# EAGLE design HelveTiny84 (EAGLE 7.5.0)

## Sheet 1 of 2
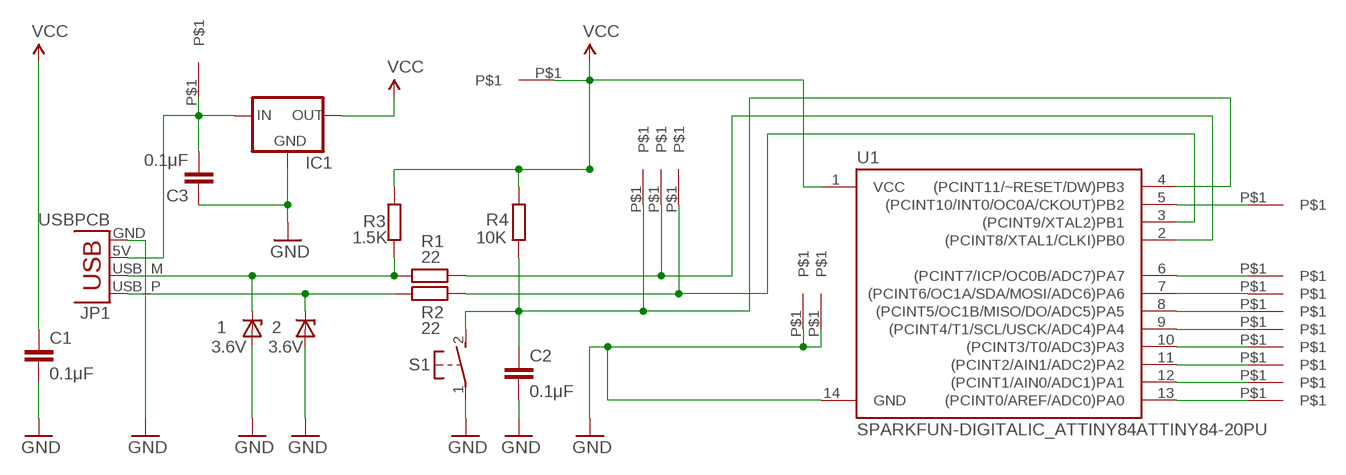
[diagram p0: schematic, sheet 1]

### Parts
1  3.6V  ZENER-DIODEZD-7.5  [ZDIO-7.5]
2  3.6V  ZENER-DIODEZD-7.5  [ZDIO-7.5]
C1  0.1μF  C-EU025-024X044  [C025-024X044]
C2  0.1μF  C-EU025-024X044  [C025-024X044]
C3  0.1μF  C-EU025-024X044  [C025-024X044]
D3  FLOWERPIN  [FLOWERPIN]
D4  FLOWERPIN  [FLOWERPIN]
D5  FLOWERPIN  [FLOWERPIN]
D6  FLOWERPIN  [FLOWERPIN]
D7  FLOWERPIN  [FLOWERPIN]
D8  FLOWERPIN  [FLOWERPIN]
IC1  MCP1700TRI  [TO92]
JP1  USBPCB  [USB-A-PCB]
R1  22  R-EU_0207/7  [0207/7]
R2  22  R-EU_0207/7  [0207/7]
R3  1.5K  R-EU_0207/7  [0207/7]
R4  10K  R-EU_0207/7  [0207/7]
S1  S3  DTS-3  [DTS-3]
TP1  FLOWERPIN  [FLOWERPIN]
TP2  FLOWERPIN  [FLOWERPIN]
TP29  FLOWERPIN  [FLOWERPIN]
TP30  FLOWERPIN  [FLOWERPIN]
TP31  FLOWERPIN  [FLOWERPIN]
TP32  FLOWERPIN  [FLOWERPIN]
TP33  FLOWERPIN  [FLOWERPIN]
TP34  FLOWERPIN  [FLOWERPIN]
TP35  FLOWERPIN  [FLOWERPIN]
TP36  FLOWERPIN  [FLOWERPIN]
U1  SPARKFUN-DIGITALIC_ATTINY84ATTINY84-20PU  [SPARKFUN-DIGITALIC_DIL14]

### Nets
D0: TP33.P$1 U1.13((PCINT0/AREF/ADC0)PA0)
D1: TP34.P$1 U1.12((PCINT1/AIN0/ADC1)PA1)
D2: TP35.P$1 U1.11((PCINT2/AIN1/ADC2)PA2)
GND: 1.A 2.A C1.2 C2.2 C3.1 IC1.1(GND) JP1.GND S1.1 TP2.P$1 TP32.P$1 U1.14(GND)
N$1: D7.P$1 U1.6((PCINT7/ICP/OC0B/ADC7)PA7)
N$2: D6.P$1 U1.7((PCINT6/OC1A/SDA/MOSI/ADC6)PA6)
N$5: D5.P$1 U1.8((PCINT5/OC1B/MISO/DO/ADC5)PA5)
N$6: D4.P$1 U1.9((PCINT4/T1/SCL/USCK/ADC4)PA4)
N$7: D3.P$1 U1.10((PCINT3/T0/ADC3)PA3)
N$8: D8.P$1 U1.5((PCINT10/INT0/OC0A/CKOUT)PB2)
RESET: C2.1 R4.1 S1.2 TP29.P$1 U1.4((PCINT11/~RESET/DW)PB3)
USB-IN-M: 1.C JP1.USB_M(D-) R1.1 R3.1
USB-IN-P: 2.C JP1.USB_P(D+) R2.1
USB-M: R1.2 TP30.P$1 U1.2((PCINT8/XTAL1/CLKI)PB0)
USB-P: R2.2 TP31.P$1 U1.3((PCINT9/XTAL2)PB1)
VCC: C1.1 IC1.3(OUT) R3.2 R4.2 TP36.P$1 U1.1(VCC)
VIN: C3.2 IC1.2(IN) JP1.5V(VBUS) TP1.P$1

## Sheet 2 of 2

## Library data of the parts
1 2 = mod_diode:ZENER-DIODE: Z-Diode
C1-C3 = rcl:C-EU: CAPACITOR, European symbol
D3-D8 TP1 TP2 TP29-TP36 = ZZFlowerpad:FLOWERPIN: Flower Pad Prototype
IC1 = adafruit:MCP1700: VOLTAGE REGULATOR
JP1 = SparkFun-Connectors:USB: USB Connectors USB-B-PTH is fully proven SKU : PRT-00139/CONN-08278 USB-miniB is fully proven SKU : PRT-00587 USB-A-PCB is untested. USB-A-H is throughly reviewed, but untested. Spark Fun Electronics SKU : PRT-00437 USB-B-SMT is throughly reviewed, but untested. Needs silkscreen touching up. USB-A-S has not been used/tested USB-MB-H has not been used/tested USB-MICROB has been used. CONN-09505
R1-R4 = rcl:R-EU_: RESISTOR, European symbol
S1 = switch-tact:DTS-3
U1 = HelveTiny84_1.0:SPARKFUN-DIGITALIC_ATTINY84: Atmel 14-pin 2/4/8kB flash uC

## Board
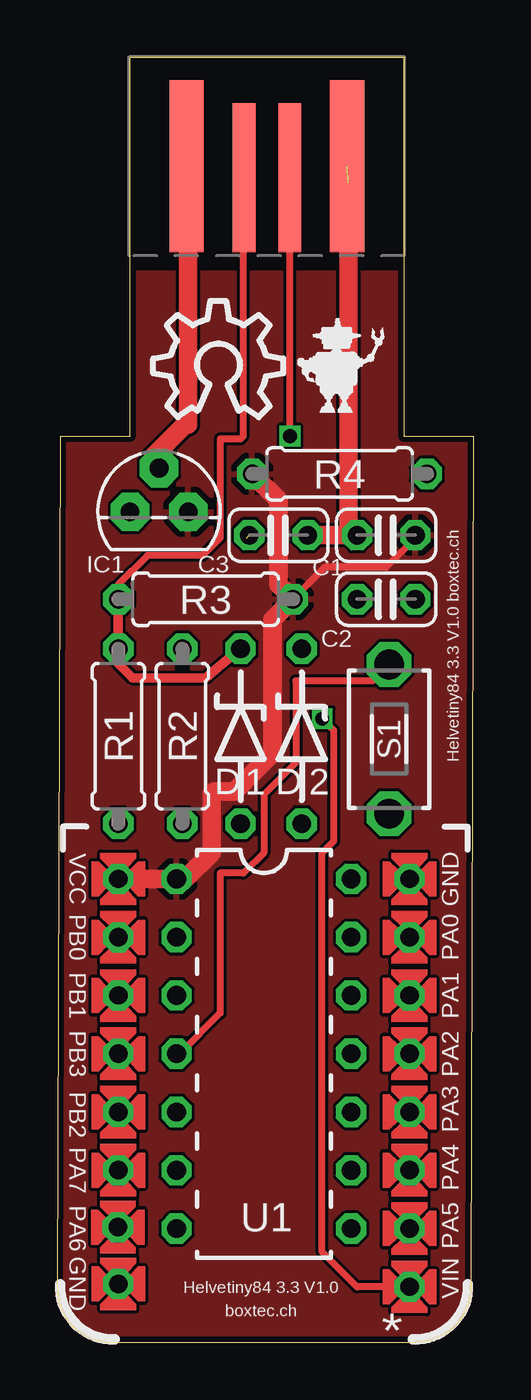
[diagram p1: board, top side]
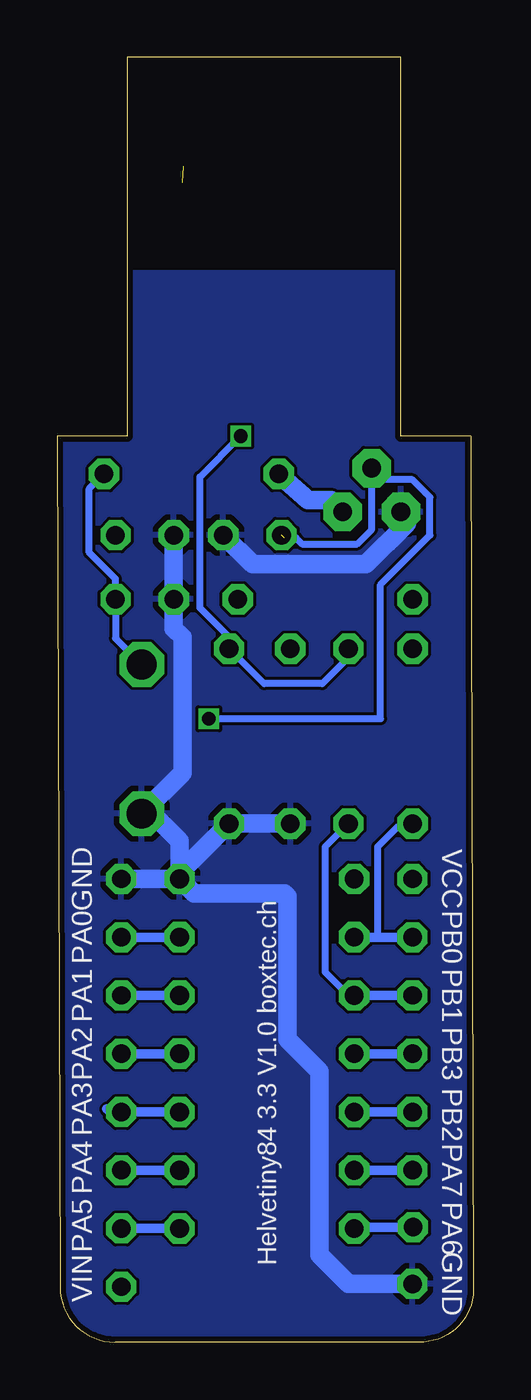
[diagram p2: board, bottom side, seen from below]

Size 18.15 x 56.01 mm. Coordinates in mm from the lower left corner, seen from the top.
Outline: 18.15,39.49 18.03,2.39 arc-90 15.64,0 2.39,0 arc-90 0,2.27 0.12,39.5
Outline: 18.15,39.5 15.11,39.5 15.11,56.01 3.17,56.01 3.17,39.5 0.12,39.5
Copper layers (1*16): Top 0.035mm / dielectric 1.5mm / Bottom 0.035mm
Design rules "dirt_cheap_dirty_boards.v1": minimum track width 5mil, minimum drill 12mil, track to track 5mil, track to pad 5mil, pad to pad 5mil, via to via 5mil, smd to smd 0mil, copper to edge 10mil, drill to drill 10mil, minimum pad ring 10mil, minimum via ring 6mil, stop-mask expansion 2mil, vias tented up to drill 25mil, thermal gap 10mil

### Footprints (pad centres in the part's own frame; a part is rotated, then mirrored left to right if it is on the bottom)
ZDIO-7.5 = drill 0.813 octagon: A 3.81,0; C -3.81,0
C025-024X044 = drill 0.813 octagon: 1 -1.27,0; 2 1.27,0
FLOWERPIN = drill 0.8 octagon: P$1 0,0
TO92 = drill 0.813 pad 1.676 octagon: 1 -1.27,0; 2 0,1.905; 3 1.27,0
USB-A-PCB = smd 7.5 x 1.5: 5V -0.2,-3.5; GND -0.2,3.5 | smd 6.5 x 1: USB_M 0.3,-1; USB_P 0.3,1
0207/7 = drill 0.813 octagon: 1 -3.81,0; 2 3.81,0
DTS-3 = drill 1.3 octagon: 1 -3.25,0; 2 3.25,0
SPARKFUN-DIGITALIC_DIL14 = drill 0.813 octagon: 1 -8.89,-3.81; 2 -6.35,-3.81; 3 -3.81,-3.81; 4 -1.27,-3.81; 5 1.27,-3.81; 6 3.81,-3.81; 7 6.35,-3.81; 8 6.35,3.81; 9 3.81,3.81; 10 1.27,3.81; 11 -1.27,3.81; 12 -3.81,3.81; 13 -6.35,3.81; 14 -8.89,3.81

### Placement (x,y rotation side)
1  7.99,26.42 270 top
2  10.66,26.42 270 top
C1  14.34,35.18 180 top
C2  14.34,32.38 180 top
C3  9.64,35.18 180 top
D3  15.36,10.03 0 top
D4  15.36,7.49 0 top
D5  15.36,4.95 0 top
D6  2.64,5.01 0 top
D7  2.66,7.49 0 top
D8  2.66,10.03 0 top
IC1  4.44,36.2 0 top
JP1  9.14,51.05 270 top
R1  2.66,26.42 270 top
R2  5.45,26.42 270 top
R3  6.47,32.38 0 top
R4  12.31,37.85 180 top
S1  14.47,26.29 90 top
TP1  15.36,2.41 0 top
TP2  2.66,2.54 0 top
TP29  2.66,12.57 0 top
TP30  2.66,17.65 0 top
TP31  2.66,15.11 0 top
TP32  15.36,20.19 0 top
TP33  15.36,17.65 0 top
TP34  15.36,15.11 0 top
TP35  15.36,12.57 0 top
TP36  2.66,20.19 0 top
U1  9.01,11.3 270 top
U$1  [OSHW_10X200_NOTEXT]  4.18,40.32 0 top

### Tracks (layer width: path | path; a pad name or v marks a point on that pad's centre or on a via)
D0
  Bottom 0.406: U1.13 TP33.P$1
D1
  Bottom 0.406: U1.12 TP34.P$1
D2
  Bottom 0.406: TP35.P$1 U1.11
GND  (1 unrouted)
  Top 0.813: 12.69,50.55 12.69,35.56 C1.2 C3.1
  Bottom 0.813: 1.A 2.A 12.82,20.45 U1.14 | C1.2 C2.2 13.07,31.12 12.69,30.73 12.69,24.82 S1.1 14.01,23.04 12.82,21.84 U1.14 | C3.1 9.64,33.91 4.69,33.91 2.91,35.69 2.91,35.94 IC1.1 | TP32.P$1 U1.14 | U1.14 12.18,19.56 8.25,19.56 8.12,19.43 8.12,13.21 6.72,11.81 6.72,3.81 5.45,2.54 TP2.P$1
  pour Bottom: 3.29,46.61 14.98,46.61 14.98,39.37 18.03,39.37 17.91,2.37 arc-90 15.66,0.13 2.21,0.13 arc-90 0.13,2.22 0.25,39.37 3.29,39.37
N$1
  Bottom 0.406: D7.P$1 U1.6
N$2
  Bottom 0.406: D6.P$1 5.14,5.01 U1.7
N$5
  Bottom 0.406: U1.8 D5.P$1
N$6
  Bottom 0.406: U1.9 D4.P$1
N$7
  Bottom 0.406: U1.10 D3.P$1 | D3.P$1 15.87,10.03 15.99,10.16 15.49,10.16 D3.P$1
N$8
  Bottom 0.406: D8.P$1 U1.5
RESET
  Top 0.305: S1.2 13.76,28.83 10.41,28.83 10.41,25.27 9.01,23.88 9.01,21.34 8.12,20.45 7.1,20.45 7.1,14.35 5.33,12.57 U1.4
  Bottom 0.305: R4.1 16.76,37.21 16.76,34.42 15.61,33.27 C2.1 15.61,30.68 S1.2
  Bottom 0.406: TP29.P$1 U1.4
USB-IN-M
  Top 0.305: JP1.USB_M 8.12,50.74 8.12,39.5 7.99,39.37 7.1,39.37 7.1,35.05 6.34,34.29 3.93,34.29 2.66,33.02 R3.1
  Top 0.406: R3.1 R1.1 2.66,29.59 3.29,28.96 6.47,28.96 1.C
USB-IN-P  (via drill 0.6)
  Top 0.305: v10.15,39.5 10.15,50.74 JP1.USB_P
  Bottom 0.305: v10.15,39.5 11.93,37.72 11.93,32 10.66,30.73 2.C 9.14,28.7 6.6,28.7 5.45,29.84 R2.1
USB-M
  Bottom 0.305: R1.2 2.79,22.48 3.29,22.48 4.18,21.59 4.18,17.65
  Bottom 0.406: TP30.P$1 4.18,17.65 U1.2
USB-P
  Bottom 0.305: R2.2 6.47,21.59 6.47,16.13 5.45,15.11 U1.3
  Bottom 0.406: TP31.P$1 U1.3
VCC
  Top 0.305: C1.1 15.61,35.05 14.34,33.78 11.68,33.78 R3.2
  Top 0.813: TP36.P$1 U1.1 5.58,20.19 6.72,21.34 6.72,23.88 6.85,24 7.74,24 9.39,25.65 9.39,31.5 R3.2 9.64,33.02 9.64,36.7 R4.2
  Bottom 0.813: R4.2 7.23,36.7 6.22,36.7 IC1.3
  pour Top: 3.29,46.61 14.98,46.61 14.98,39.37 18.03,39.37 17.91,2.42 arc-90 15.61,0.13 2.28,0.13 arc-90 0.13,2.29 0.25,39.37 3.29,39.37
VIN  (via drill 0.6)  (1 unrouted)
  Top 0.305: TP1.P$1 13.07,2.41 11.55,3.94 11.55,21.34 12.06,21.84 12.06,26.67 v11.55,27.18
  Top 0.813: JP1.5V 5.71,51.18 5.71,40.01 5.58,40.01 4.18,38.61 4.18,38.35 IC1.2
  Bottom 0.305: v11.55,27.18 4.06,27.18 4.06,33.02 1.9,35.18 1.9,36.83 2.66,37.59 3.93,37.59 IC1.2 4.44,35.43 5.07,34.8 7.49,34.8 7.74,35.05 8.25,35.05

### Text on the board
tNames: Helvetiny84 3.3 V1.0 boxtec.ch | D | D | VCC | GND | PB0 | PA0 | PB1 | PA1 | PB3 | PA2 | PB2 | PA3 | PA7 | PA4 | PA6 | PA5 | GND | Helvetiny84 3.3 V1.0 | VIN | boxtec.ch | *
bNames: VCC | GND | PB0 | PA0 | PB1 | PA1 | PB3 | PA2 | Helvetiny84 3.3 V1.0 boxtec.ch | PB2 | PA3 | PA7 | PA4 | PA6 | PA5 | GND | VIN